# Altium schematic sheet LeftBar1_SchDoc.SchDoc
size A4
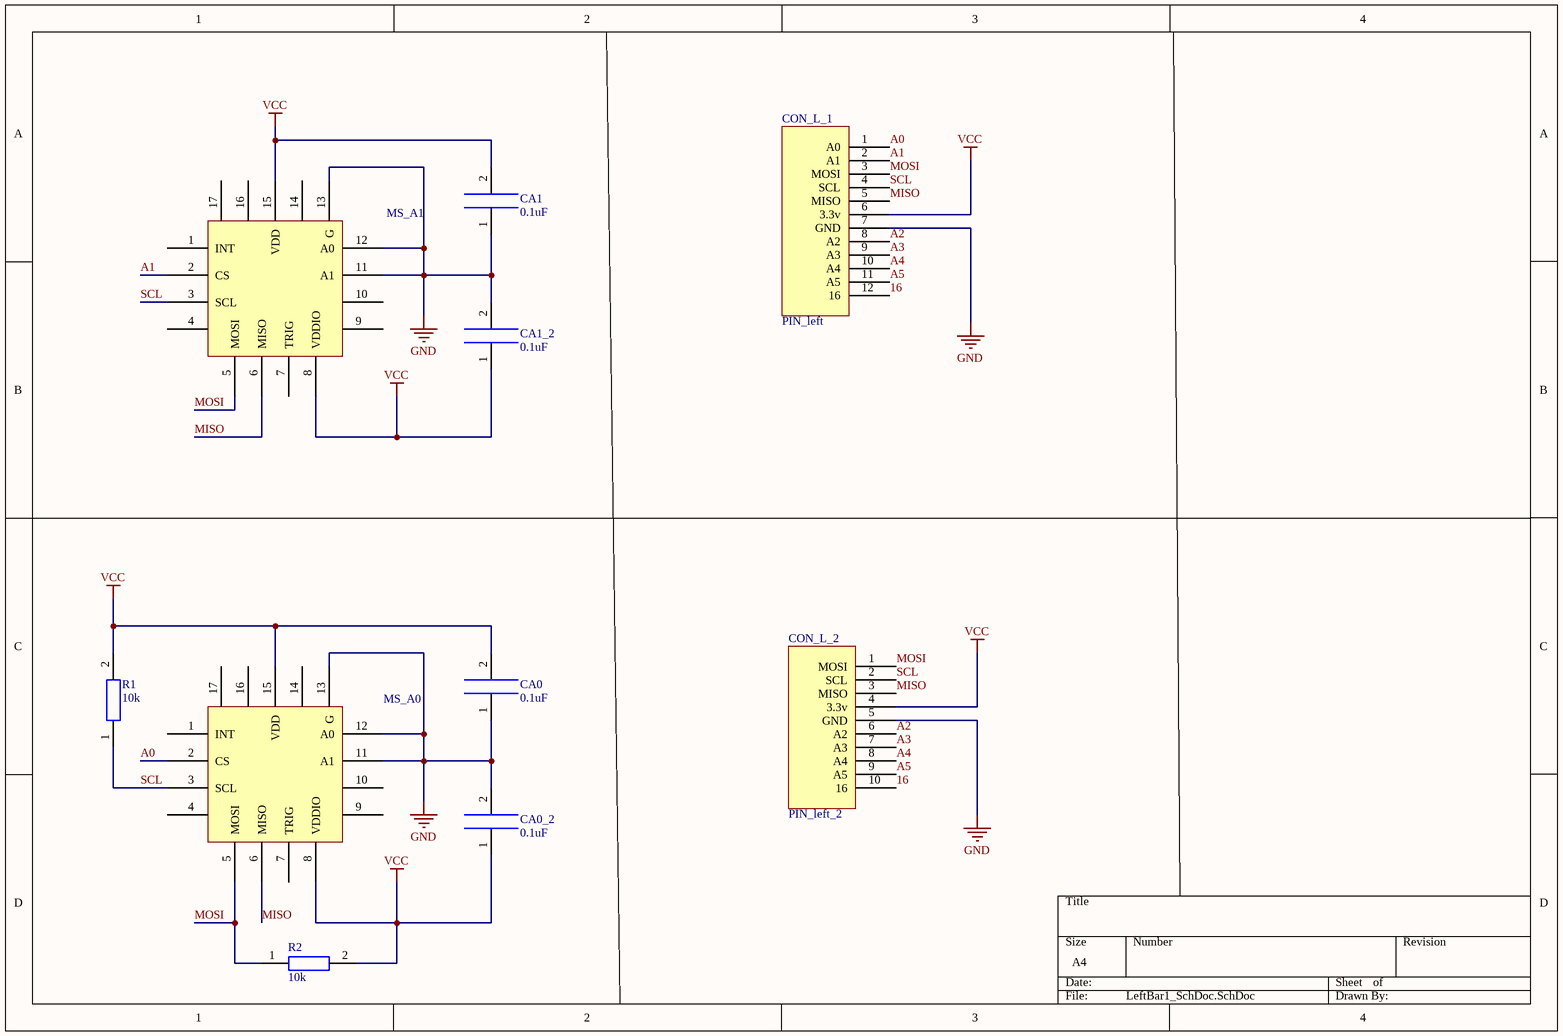
[diagram p0: LeftBar1_SchDoc.SchDoc]

## Parts
CA0  0.1uF  [CAP_0603]
CA0_2  0.1uF  [CAP_0603]
CA1  0.1uF  [CAP_0603]
CA1_2  0.1uF  [CAP_0603]
CON_L_1  PIN_left  [PIN_left]
CON_L_2  PIN_left_2  [PIN_Left_2]
MS_A0  MLX90393SLW ABA 011 RE  [MLX90393]  (value not drawn)
MS_A1  MLX90393SLW ABA 011 RE  [MLX90393]  (value not drawn)
R1  10k  [RES_0603]
R2  10k  [RES_0603]

## Nets
GND: CA0.1 CA0_2.2 CA1.1 CA1_2.2 CON_L_1.7(GND) CON_L_2.5(GND) MS_A0.11(A1) MS_A0.12(A0) MS_A0.13(G) MS_A1.11(A1) MS_A1.12(A0) MS_A1.13(G)
VCC: CA0.2 CA0_2.1 CA1.2 CA1_2.1 CON_L_1.6(3.3v) CON_L_2.4(3.3v) MS_A0.8(VDDIO) MS_A0.15(VDD) MS_A1.8(VDDIO) MS_A1.15(VDD) R1.2 R2.2
16: CON_L_1.12(16) CON_L_2.10(16)
A0: CON_L_1.1(A0) MS_A0.2(CS)
A1: CON_L_1.2(A1) MS_A1.2(CS)
A2: CON_L_1.8(A2) CON_L_2.6(A2)
A3: CON_L_1.9(A3) CON_L_2.7(A3)
A4: CON_L_1.10(A4) CON_L_2.8(A4)
A5: CON_L_1.11(A5) CON_L_2.9(A5)
MISO: CON_L_1.5(MISO) CON_L_2.3(MISO) MS_A0.6(MISO) MS_A1.6(MISO)
MOSI: CON_L_1.3(MOSI) CON_L_2.1(MOSI) MS_A0.5(MOSI) MS_A1.5(MOSI) R2.1
SCL: CON_L_1.4(SCL) CON_L_2.2(SCL) MS_A0.3(SCL) MS_A1.3(SCL) R1.1

Not connected (* = marked no-connect by the designer): MS_A0 1(INT) 4 7(TRIG) 9 10 14 16 17; MS_A1 1(INT) 4 7(TRIG) 9 10 14 16 17

## Library data of the parts
CA0 CA0_2 CA1 CA1_2 = CAP: Capacitance
MS_A0 MS_A1 = MLX90393SLW ABA 011 RE: MLX90393 Sensor
R1 R2 = RES: Resistance